# Altium schematic sheet PowerSupply.SchDoc: 5V 3A Power Supply
size A4
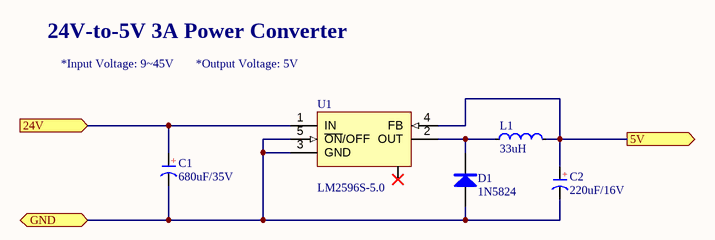
[diagram p0: PowerSupply.SchDoc]

## Parts
C1  680uF/35V  [CM G(12.5*13.5)]
C2  220uF/16V  [CM D(6.3*7.7)]
D1  1N5824  [SMA]
L1  Inductance: 33uH  [SMD-11.5x10.5]  (hidden comment: InductanceSMD)
U1  LM2596S-5.0  [TO263-5A]

## Ports
5V (out), 24V (in), GND (bidir)

## Nets
5V: C2.1(A) L1.2 U1.4(FB) ; port 5V
24V: C1.1(A) U1.1(IN) ; port 24V
GND: C1.2(K) C2.2(K) D1.1(A) U1.3(GND) U1.5(~{ON}/OFF) ; port GND
NetD1_2: D1.2(K) L1.1 U1.2(OUT)

Not connected (* = marked no-connect by the designer): U1 6*

## Notes on the sheet
- 24V-to-5V 3A Power Converter
- *Input Voltage: 9~45V
- *Output Voltage: 5V
- Title
- FileName:
- Version:
- Date:
- Project
- Designed By:
- Descriptions:
- Sheet:
- of
- (in symbol CE_SMD) +

## Library data of the parts
C1 = CE_SMD: 贴片电解电容 C542257; 版权归属: 封装库来自淘宝 ID：黄晶宝石; BOM名称: 贴片电解电容; 联系售后: https://shop463601444.taobao.com
C2 = CE_SMD: 贴片电解电容 C278407; 版权归属: 封装库来自淘宝 ID：黄晶宝石; BOM名称: 贴片电解电容; 联系售后: https://shop463601444.taobao.com
D1 = M7: 整流二极管 C727065; 版权归属: 封装库来自淘宝 ID：黄晶宝石; BOM名称: 整流二极管; 学习资源: https://shop463601444.taobao.com
L1 = InductanceSMD: C280568 / (MHCC10040-330M-R7)
U1 = LM2596S-5.0: 5V稳压芯片; Note: Tab is connected to GND; Published: 15-Apr-2002; DatasheetVersion: Dec-1997; PackageReference: TS5B; Publisher: Altium Limited; PackageDescription: D2-PAK; 5 Leads; Body 14.4 (inc. leads) x 10.4 mm (LxW max); ComponentLink1Description: Manufacturer Link; ComponentLink1URL: http://www.national.com/; ComponentLink2Description: Datasheet; ComponentLink2URL: http://www.national.com/ds.cgi/LM/LM2596.pdf; ComponentLink3Description: URL Link1; ComponentLink3URL: http://www.national.com/pf/LM/LM2596.html